# EAGLE design pcb (EAGLE 7.5.0)
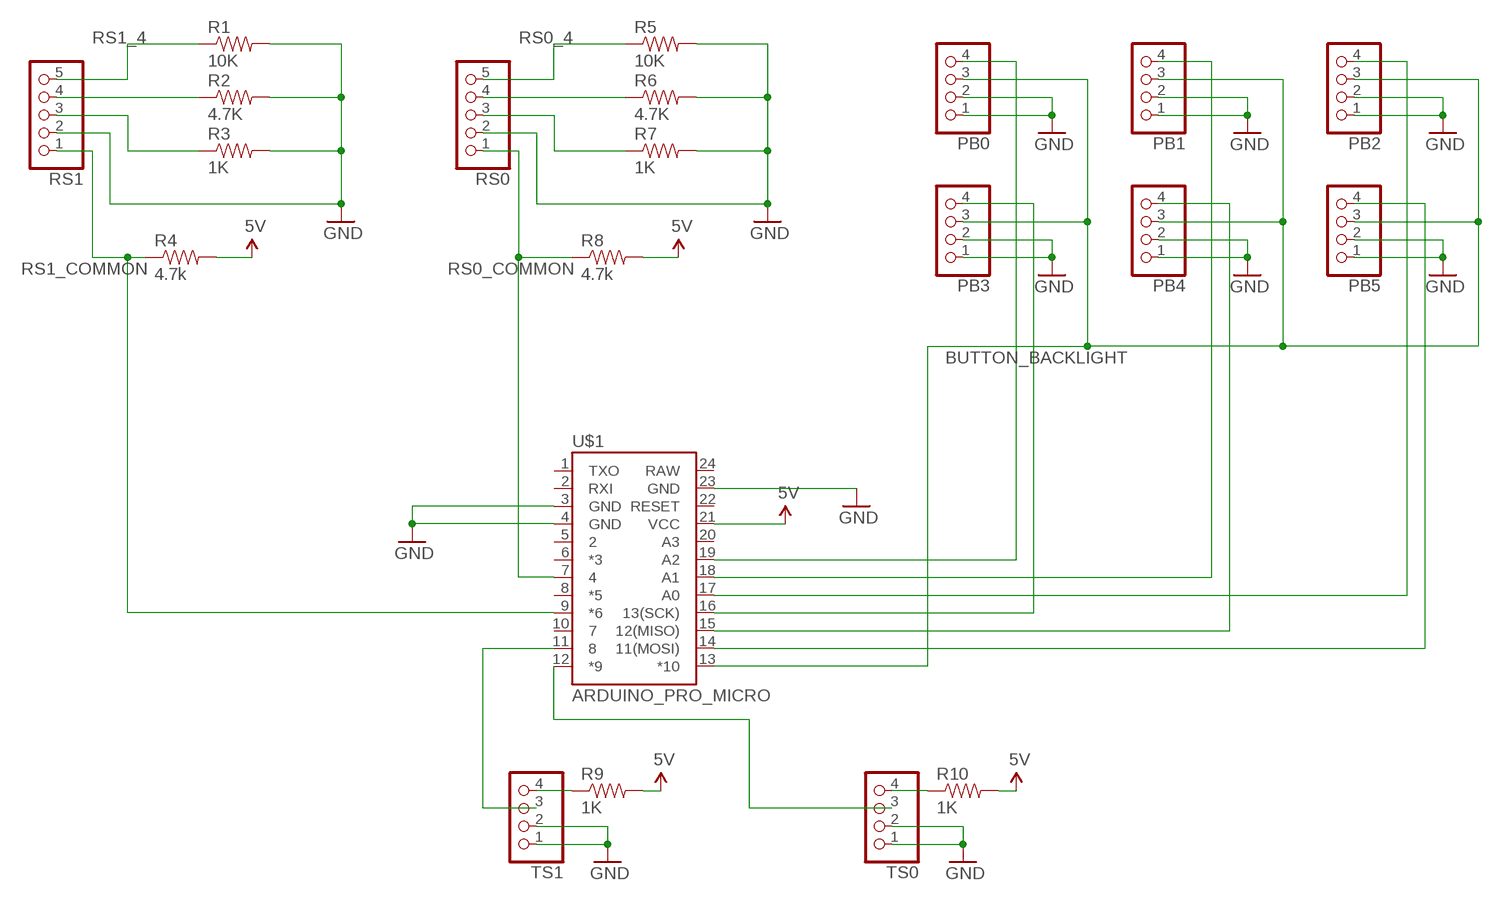
[diagram p0: schematic, sheet 1]

## Parts
PB0  PINHD-1X4  [1X04]
PB1  PINHD-1X4  [1X04]
PB2  PINHD-1X4  [1X04]
PB3  PINHD-1X4  [1X04]
PB4  PINHD-1X4  [1X04]
PB5  PINHD-1X4  [1X04]
R1  10K  1KOHM-1/4W-1%(PTH)HORIZ-KIT  [AXIAL-0.3EZ]
R2  4.7K  1KOHM-1/4W-1%(PTH)HORIZ-KIT  [AXIAL-0.3EZ]
R3  1K  1KOHM-1/4W-1%(PTH)HORIZ-KIT  [AXIAL-0.3EZ]
R4  4.7k  1KOHM-1/4W-1%(PTH)HORIZ-KIT  [AXIAL-0.3EZ]
R5  10K  1KOHM-1/4W-1%(PTH)HORIZ-KIT  [AXIAL-0.3EZ]
R6  4.7K  1KOHM-1/4W-1%(PTH)HORIZ-KIT  [AXIAL-0.3EZ]
R7  1K  1KOHM-1/4W-1%(PTH)HORIZ-KIT  [AXIAL-0.3EZ]
R8  4.7k  1KOHM-1/4W-1%(PTH)HORIZ-KIT  [AXIAL-0.3EZ]
R9  1K  1KOHM-1/4W-1%(PTH)HORIZ-KIT  [AXIAL-0.3EZ]
R10  1K  1KOHM-1/4W-1%(PTH)HORIZ-KIT  [AXIAL-0.3EZ]
RS0  PINHD-1X5  [1X05]
RS1  PINHD-1X5  [1X05]
TS0  PINHD-1X4  [1X04]
TS1  PINHD-1X4  [1X04]
U$1  ARDUINO_PRO_MICRO  [ARDUINO_PRO_MICRO]

## Nets
5V: R4.P$2 R8.P$2 R9.P$2 R10.P$2 U$1.21(VCC)
BUTTON_BACKLIGHT: PB0.3 PB1.3 PB2.3 PB3.3 PB4.3 PB5.3 U$1.13(*10)
GND: PB0.1 PB0.2 PB1.1 PB1.2 PB2.1 PB2.2 PB3.1 PB3.2 PB4.1 PB4.2 PB5.1 PB5.2 R1.P$2 R2.P$2 R3.P$2 R5.P$2 R6.P$2 R7.P$2 RS0.2 RS1.2 TS0.1 TS0.2 TS1.1 TS1.2 U$1.3(GND) U$1.4(GND) U$1.23(GND)
N$1: R9.P$1 TS1.4
N$2: R10.P$1 TS0.4
N$3: TS1.3 U$1.11
N$4: PB5.4 U$1.14(11(MOSI))
N$5: PB4.4 U$1.15(12(MISO))
N$6: PB3.4 U$1.16(13(SCK))
N$7: PB2.4 U$1.17(A0)
N$8: PB1.4 U$1.18(A1)
N$9: PB0.4 U$1.19(A2)
N$10: TS0.3 U$1.12(*9)
RS0_2: R7.P$1 RS0.3
RS0_3: R6.P$1 RS0.4
RS0_4: R5.P$1 RS0.5
RS0_COMMON: R8.P$1 RS0.1 U$1.7
RS1_2: R3.P$1 RS1.3
RS1_3: R2.P$1 RS1.4
RS1_4: R1.P$1 RS1.5
RS1_COMMON: R4.P$1 RS1.1 U$1.9(*6)
Unconnected: U$1.1(TXO) U$1.2(RXI) U$1.5 U$1.6(*3) U$1.8(*5) U$1.10 U$1.20(A3) U$1.22(RESET) U$1.24(RAW)

## Library data of the parts
PB0 PB1-PB5 TS0 TS1 = pinhead:PINHD-1X4: PIN HEADER
R1 R2 R4-R6 R8 = SparkFun-Resistors:1KOHM-1/4W-1%(PTH): RES-12182; PROD_ID: RES-12182; VALUE: 1K
R3 R7 R9 R10 = SparkFun-Resistors:1KOHM-1/4W-1%(PTH): RES-12182; PROD_ID: RES-12182
RS0 RS1 = pinhead:PINHD-1X5: PIN HEADER
U$1 = SparkFun-Boards:ARDUINO_PRO_MICRO

## Board
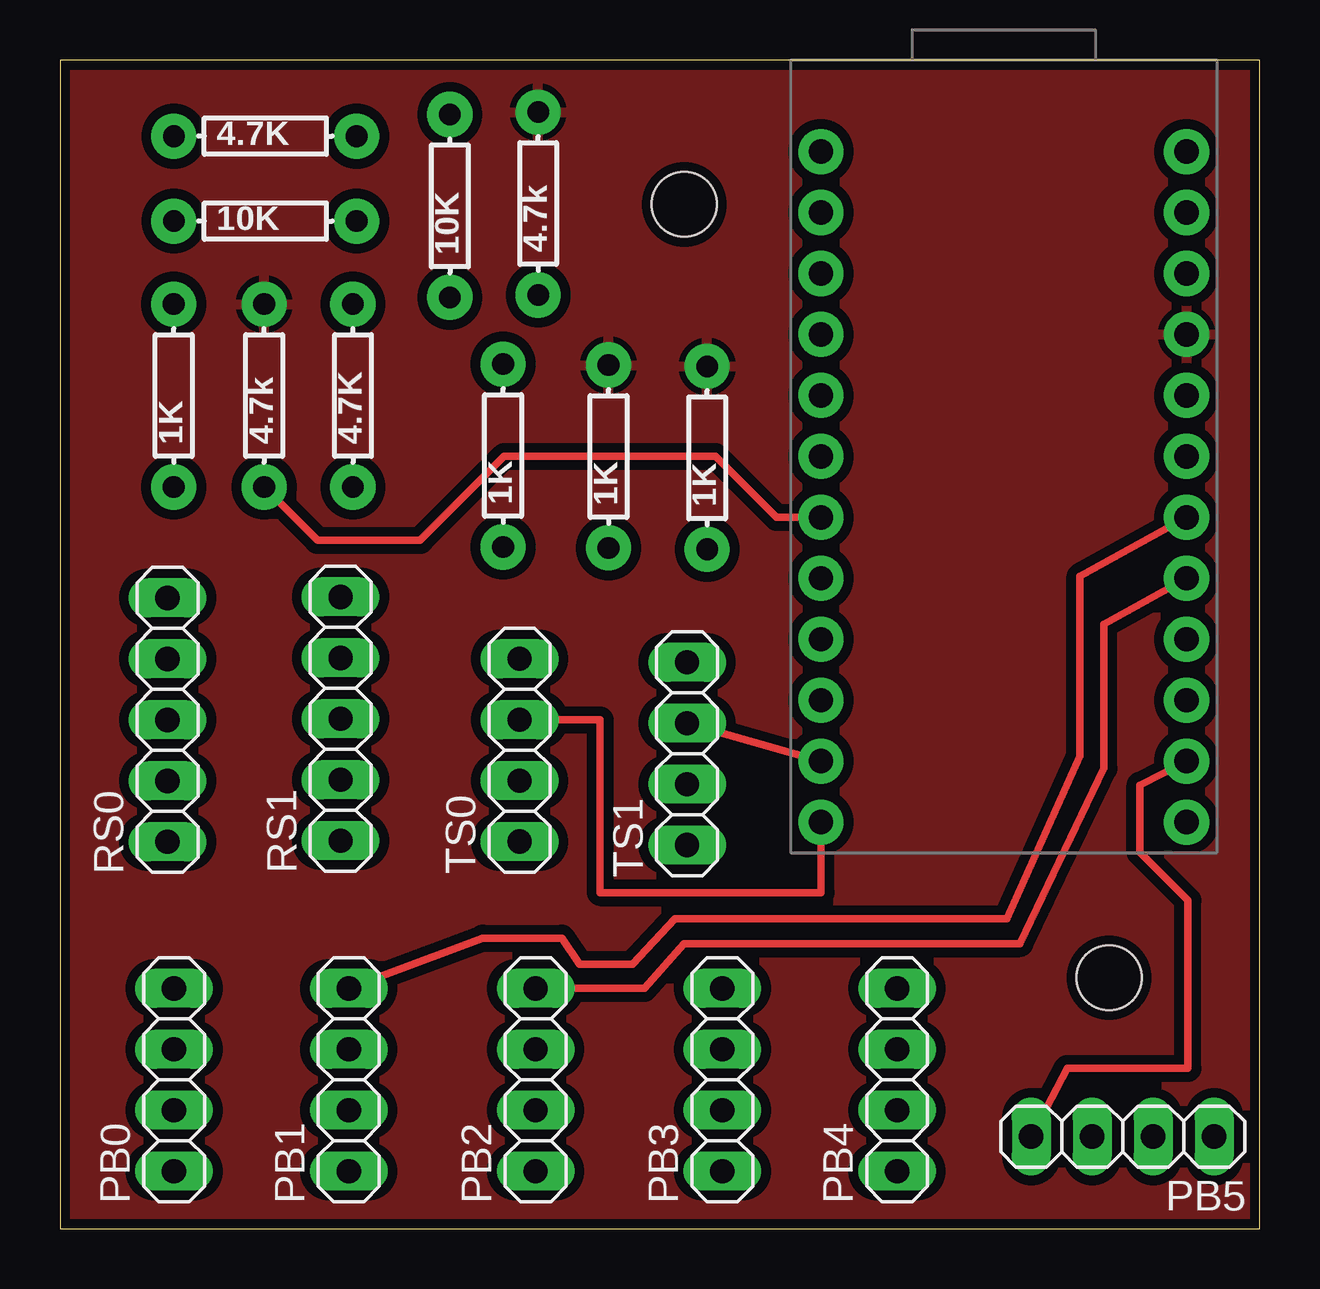
[diagram p1: board, top side]
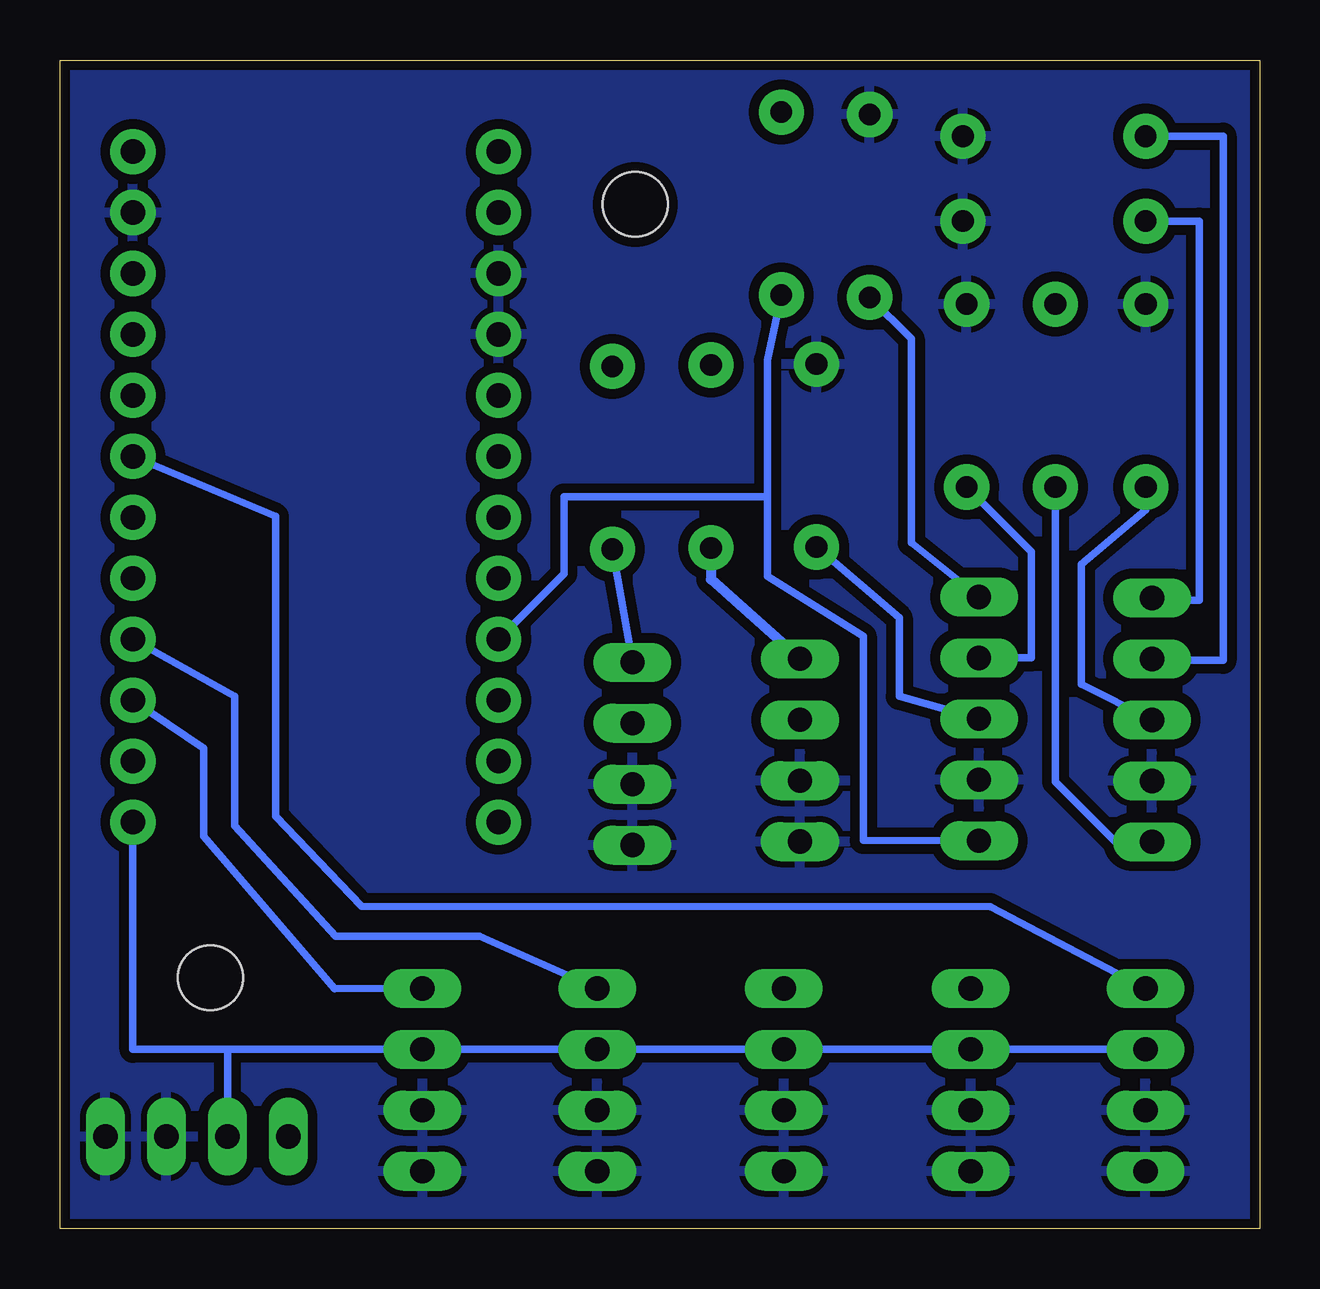
[diagram p2: board, bottom side, seen from below]

Size 50 x 48.7 mm. Coordinates in mm from the lower left corner, seen from the top.
Outline: 0,0 50,0 50,48.7 0,48.7 0,0
Copper layers (1*16): Top 0.035mm / dielectric 1.5mm / Bottom 0.035mm
Design rules "SparkFun": minimum track width 8mil, minimum drill 20mil, track to track 8mil, track to pad 8mil, pad to pad 8mil, via to via 8mil, smd to smd 8mil, copper to edge 10mil, drill to drill 8mil, minimum pad ring 12mil, minimum via ring 10mil, stop-mask expansion 4mil, vias tented up to drill 25mil, thermal gap 10mil
Holes 2.7 mm at 26.02,42.68 43.73,10.46

### Footprints (pad centres in the part's own frame; a part is rotated, then mirrored left to right if it is on the bottom)
1X04 = drill 1.016 long: 1 -3.81,0; 2 -1.27,0; 3 1.27,0; 4 3.81,0
AXIAL-0.3EZ = drill 0.9 pad 1.88: P$1 -3.81,0; P$2 3.81,0
1X05 = drill 1.016 long: 1 -5.08,0; 2 -2.54,0; 3 0,0; 4 2.54,0; 5 5.08,0
ARDUINO_PRO_MICRO = drill 1.016 pad 1.88: 1 -7.62,12.7; 2 -7.62,10.16; 3 -7.62,7.62; 4 -7.62,5.08; 5 -7.62,2.54; 6 -7.62,0; 7 -7.62,-2.54; 8 -7.62,-5.08; 9 -7.62,-7.62; 10 -7.62,-10.16; 11 -7.62,-12.7; 12 -7.62,-15.24; 13 7.62,-15.24; 14 7.62,-12.7; 15 7.62,-10.16; 16 7.62,-7.62; 17 7.62,-5.08; 18 7.62,-2.54; 19 7.62,0; 20 7.62,2.54; 21 7.62,5.08; 22 7.62,7.62; 23 7.62,10.16; 24 7.62,12.7

### Placement (x,y rotation side)
PB0  4.76,6.21 90 top
PB1  12.04,6.21 90 top
PB2  19.83,6.21 90 top
PB3  27.61,6.21 90 top
PB4  34.9,6.21 90 top
PB5  44.3,3.84 180 top
R1  16.25,42.62 90 top
R2  12.21,34.72 90 top
R3  18.47,32.22 90 top
R4  19.93,42.72 90 top
R5  8.56,41.98 0 top
R6  8.56,45.52 0 top
R7  4.74,34.72 90 top
R8  8.51,34.72 90 top
R9  26.98,32.12 90 top
R10  22.87,32.18 90 top
RS0  4.48,21.2 90 top
RS1  11.7,21.25 90 top
TS0  19.16,19.94 90 top
TS1  26.14,19.79 90 top
U$1  39.34,32.18 0 top

### Tracks (layer width: path | path; a pad name or v marks a point on that pad's centre or on a via)
5V
  pour Top (isolate 0.406): -0.16,48.69 -0.16,0.01 50.35,0.01 50.35,48.69
BUTTON_BACKLIGHT
  Bottom 0.305: PB0.3 PB1.3 PB2.3 PB3.3 PB4.3 43.02,7.48 | 43.02,7.48 46.96,7.48 U$1.13 | PB5.3 43.02,3.35 43.02,7.48
GND
  pour Bottom (isolate 0.406): 0.02,49.18 50.52,48.68 50.52,-0.32 0.02,0.18
N$1
  Bottom 0.305: R9.P$1 TS1.4
N$2
  Bottom 0.406: R10.P$1 22.86,27.06 TS0.4
N$3
  Top 0.305: TS1.3 U$1.11
N$4
  Top 0.305: PB5.4 41.98,6.68 47.02,6.68 47.02,13.69 45.02,15.69 45.02,18.48 U$1.14
N$5
  Bottom 0.305: PB4.4 38.55,10.01 44.02,16.35 44.02,20.02 U$1.15
N$6
  Bottom 0.305: PB3.4 32.52,12.19 38.52,12.19 42.72,16.79 42.72,22.18 U$1.16
N$7
  Top 0.305: PB2.4 24.36,10.02 26.02,11.88 40.02,11.88 43.52,19.18 43.52,25.18 U$1.17
N$8
  Top 0.305: PB1.4 17.62,12.11 20.92,12.11 21.66,11.02 23.87,11.02 25.64,12.92 39.48,12.92 42.52,19.68 42.52,27.18 U$1.18
N$9
  Bottom 0.305: PB0.4 11.22,13.43 37.44,13.44 41.02,17.18 41.02,29.68 U$1.19
N$10
  Top 0.305: TS0.3 22.52,21.21 22.52,14 31.72,14 U$1.12
RS0_2
  Bottom 0.305: R7.P$1 4.74,29.96 7.42,27.68 7.42,22.68 RS0.3
RS0_3
  Bottom 0.305: R6.P$1 1.52,45.52 1.52,23.68 4.71,23.68 RS0.4
RS0_4
  Bottom 0.305: R5.P$1 2.52,41.98 2.52,26.18 4.71,26.18 RS0.5
RS0_COMMON
  Top 0.305: R8.P$1 10.73,28.68 15.02,28.68 18.52,32.19 27.32,32.19 29.87,29.65 U$1.7
  Bottom 0.305: R8.P$1 8.51,18.62 6.01,16.12 RS0.1
RS1_2
  Bottom 0.305: R3.P$1 15.02,25.46 15.02,22.18 RS1.3
RS1_3
  Bottom 0.305: R2.P$1 9.52,28.22 9.52,23.79 RS1.4
RS1_4
  Bottom 0.305: R1.P$1 14.52,37.08 14.52,28.59 RS1.5
RS1_COMMON
  Bottom 0.305: R4.P$1 20.52,36.19 20.52,30.5 | 20.52,30.5 20.52,27.18 16.52,24.68 16.52,16.18 RS1.1 | U$1.9 29,27.29 29,30.5 20.52,30.5